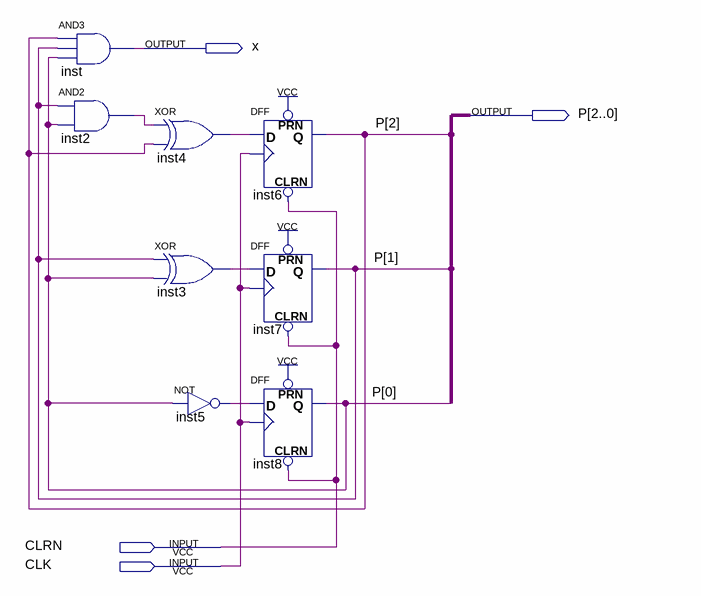
[diagram p0: schematic sheet]
// Quartus schematic Counter.bdf as structural Verilog: 8 symbols, 4 pins
module Counter (
  input  CLRN,
  input  CLK,
  output x,
  output [2:0] P
);

  wire inst2_out, inst3_out, inst4_out, inst5_out;

  and inst (x, P[2], P[1], P[0]);
  and inst2 (inst2_out, P[1], P[0]);
  xor inst4 (inst4_out, inst2_out, P[2]);
  xor inst3 (inst3_out, P[1], P[0]);
  not inst5 (inst5_out, P[0]);
  DFF inst6 (.CLRN(CLRN), .CLK(CLK), .D(inst4_out), .PRN(1'b1), .Q(P[2]));
  DFF inst7 (.CLRN(CLRN), .CLK(CLK), .D(inst3_out), .PRN(1'b1), .Q(P[1]));
  DFF inst8 (.CLRN(CLRN), .CLK(CLK), .D(inst5_out), .PRN(1'b1), .Q(P[0]));
endmodule
